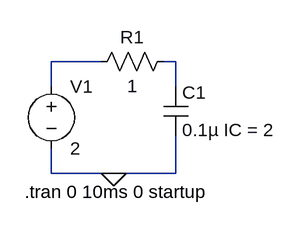
[diagram p0: schematic RC.asc]
RC.asc, the LTspice schematic file:
Version 4
SHEET 1 880 680
WIRE 112 112 48 112
WIRE 208 112 192 112
WIRE 48 144 48 112
WIRE 208 144 208 112
WIRE 48 256 48 224
WIRE 128 256 48 256
WIRE 208 256 208 208
WIRE 208 256 128 256
FLAG 128 256 0
SYMBOL voltage 48 128 R0
SYMATTR InstName V1
SYMATTR Value 2
SYMBOL res 208 96 R90
WINDOW 0 0 56 VBottom 2
WINDOW 3 32 56 VTop 2
SYMATTR InstName R1
SYMATTR Value 1
SYMBOL cap 192 144 R0
SYMATTR InstName C1
SYMATTR Value 0.1µ IC = 2
TEXT 14 280 Left 2 !.tran 0 10ms 0 startup

The netlist it stands for:
* RC.asc
V1 N001 0 2
R1 N002 N001 1
C1 N002 0 0.1µ IC = 2
.tran 0 10ms 0 startup
.backanno
.end